# Altium schematic sheet Ganancia.SchDoc
size A4
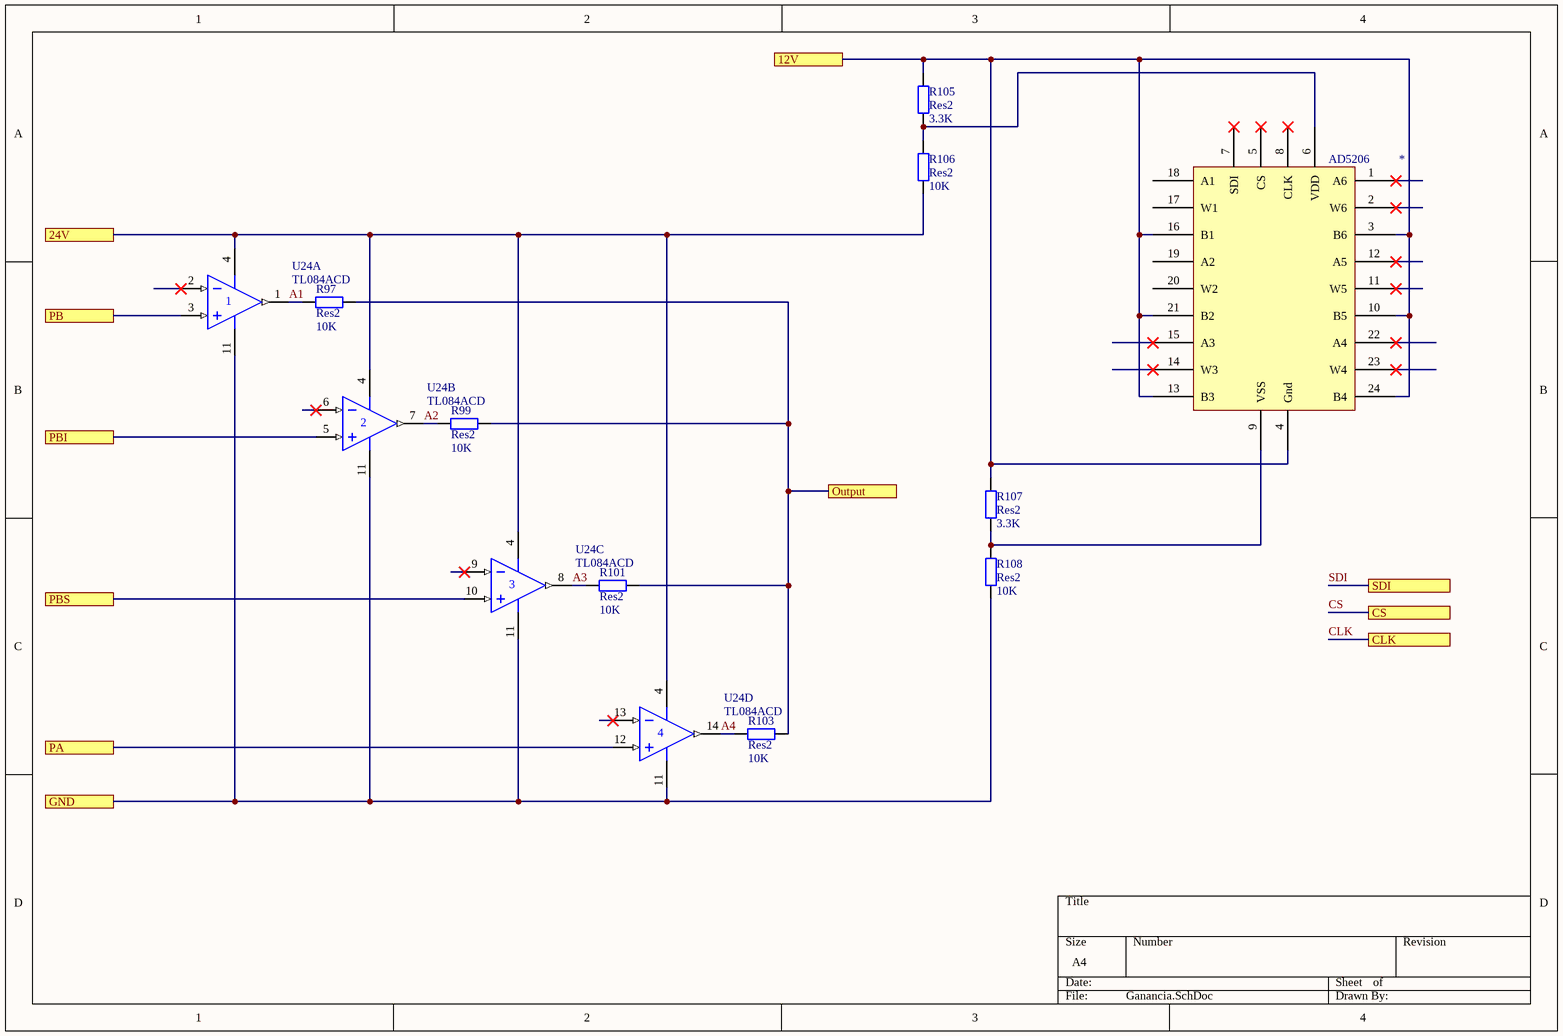
[diagram p0: Ganancia.SchDoc]

## Parts
*  AD5206  [DIP-24/D31]
R97  Res2  value 10K  [1206 resistor]
R99  Res2  value 10K  [1206 resistor]
R101  Res2  value 10K  [1206 resistor]
R103  Res2  value 10K  [1206 resistor]
R105  Res2  value 3.3K  [1206 resistor]
R106  Res2  value 10K  [1206 resistor]
R107  Res2  value 3.3K  [1206 resistor]
R108  Res2  value 10K  [1206 resistor]
U24  TL084ACD  [751A-02_N]  (parts A,B,C,D of 4)

## Ports
12V, 24V, CLK, CS, GND, Output, PA, PB, PBI, PBS, SDI

## Nets
12V: *.3(B6) *.4(Gnd) *.10(B5) *.13(B3) *.16(B1) *.21(B2) *.24(B4) R105.2 R107.2 ; port 12V
24V: R106.1 U24.4(V+) ; port 24V
A1: R97.1 U24.1(OUT)
A2: R99.1 U24.7(OUT)
A3: R101.1 U24.8(OUT)
A4: R103.1 U24.14(OUT)
CLK: port CLK
CS: port CS
GND: R108.1 U24.11(V-) ; port GND
Output: R97.2 R99.2 R101.2 R103.2 ; port Output
PA: U24.12(IN+) ; port PA
PB: U24.3(IN+) ; port PB
PBI: U24.5(IN+) ; port PBI
PBS: U24.10(IN+) ; port PBS
SDI: port SDI
Net*_6: *.6(VDD) R105.1 R106.2
Net*_9: *.9(VSS) R107.1 R108.2

Not connected (* = marked no-connect by the designer): * 1(A6)* 2(W6)* 5(CS)* 7(SDI)* 8(CLK)* 11(W5)* 12(A5)* 14(W3)* 15(A3)* 17(W1) 18(A1) 19(A2) 20(W2) 22(A4)* 23(W4)*; U24 2(IN-)* 6(IN-)* 9(IN-)* 13(IN-)*

## Library data of the parts
R97 R99 R101 R103 R105-R108 = Res2: Resistor; Published: 8-Jun-2000; LatestRevisionDate: 17-Jul-2002; LatestRevisionNote: Re-released for DXP Platform.; PackageReference: AXIAL-0.4; Publisher: Altium Limited; PackageDescription: Axial Device, Thru-Hole; 2 Leads; 0.4 in Pin Spacing
U24 = TL084ACD: JFET-Input Operational Amplifier; Published: 17-Jul-2002; LatestRevisionDate: 13-Apr-2006; LatestRevisionNote: IPC-7351 Footprint Added.; DatasheetVersion: 1988; PackageVersion: 1991; PackageReference: 751A-02; Publisher: Altium Limited; PackageDescription: 14-Pin Small Outline Integrated Circuit 1.27 mm Pitch; Code_IPC: SOIC127P600-14; ComponentLink1Description: Manufacturer Link; ComponentLink1URL: http://www.onsemi.com/site/products/parametrics/0,4446,251,00.html